# Altium schematic sheet Sensors.SchDoc
size A4
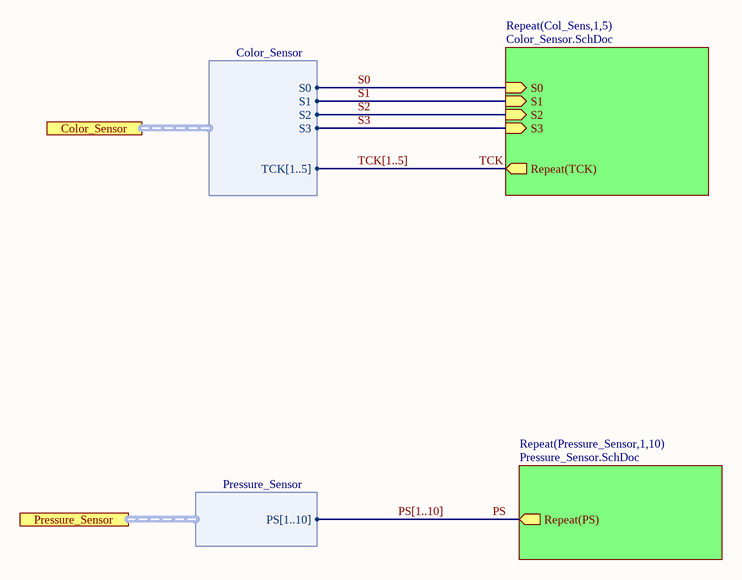
[diagram p0: Sensors.SchDoc]

## Sub-sheets
Repeat(Col_Sens,1,5) = Color_Sensor.SchDoc: S0 (in), S1 (in), S2 (in), S3 (in), Repeat(TCK) (out)
Repeat(Pressure_Sensor,1,10) = Pressure_Sensor.SchDoc: Repeat(PS) (out)

## Ports
Color_Sensor (harness Color_Sensor), Pressure_Sensor (harness Pressure_Sensor)

## Harnesses
Color_Sensor: TCK[1..5], S0, S1, S2, S3
Pressure_Sensor: PS[1..10]

## Nets
PS: sheet Repeat(Pressure_Sensor,1,10)/Repeat(PS)
S0: sheet Repeat(Col_Sens,1,5)/S0, port Color_Sensor.S0
S1: sheet Repeat(Col_Sens,1,5)/S1, port Color_Sensor.S1
S2: sheet Repeat(Col_Sens,1,5)/S2, port Color_Sensor.S2
S3: sheet Repeat(Col_Sens,1,5)/S3, port Color_Sensor.S3
TCK: sheet Repeat(Col_Sens,1,5)/Repeat(TCK)

## Buses and harness runs
bus PS[1..10]
bus TCK[1..5]